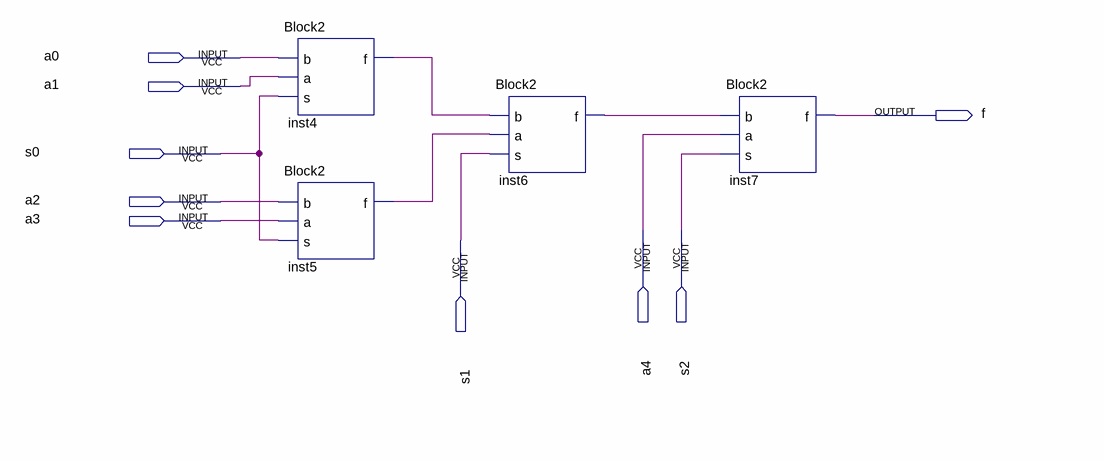
[diagram p0: schematic sheet]
// Quartus schematic Block_5_to_1_component.bdf as structural Verilog: 4 symbols, 9 pins
module Block_5_to_1_component (
  input  a0,
  input  a1,
  input  s0,
  input  a2,
  input  a3,
  input  a4,
  input  s2,
  input  s1,
  output f
);

  wire inst4_f, inst5_f, inst6_f;

  Block2 inst4 (.b(a0), .a(a1), .s(s0), .f(inst4_f));
  Block2 inst5 (.b(a2), .a(a3), .s(s0), .f(inst5_f));
  Block2 inst6 (.b(inst4_f), .a(inst5_f), .s(s1), .f(inst6_f));
  Block2 inst7 (.b(inst6_f), .a(a4), .s(s2), .f(f));
endmodule
